# Altium schematic sheet 5_radio_0.schdoc: Radio 0
size A4; DrawnBy: Sara Vega Martinez; Revision: v0.1; SheetNumber: 5; SheetTotal: 6; DesignedBy: André M. P. Mattos
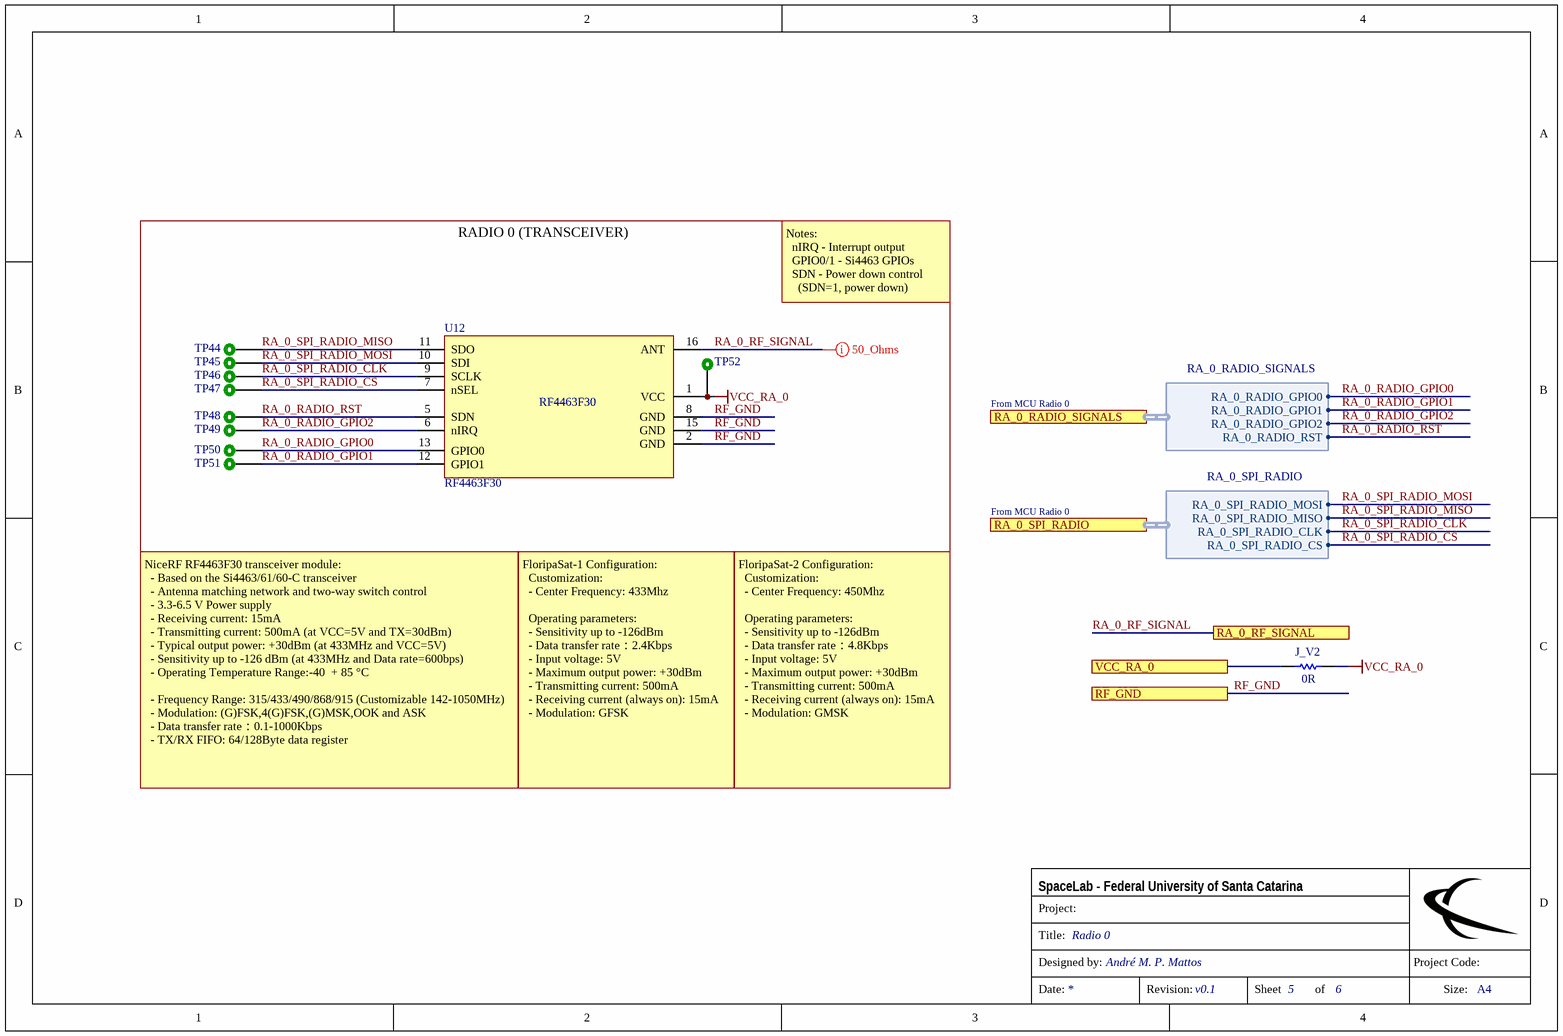
[diagram p0: 5_radio_0.schdoc]

## Parts
J_V2  0R  [0805]
TP44  TEST_POINT  [TEST_POINT_2]  (value not drawn)  (no BOM)
TP45  TEST_POINT  [TEST_POINT_2]  (value not drawn)  (no BOM)
TP46  TEST_POINT  [TEST_POINT_2]  (value not drawn)  (no BOM)
TP47  TEST_POINT  [TEST_POINT_2]  (value not drawn)  (no BOM)
TP48  TEST_POINT  [TEST_POINT_2]  (value not drawn)  (no BOM)
TP49  TEST_POINT  [TEST_POINT_2]  (value not drawn)  (no BOM)
TP50  TEST_POINT  [TEST_POINT_2]  (value not drawn)  (no BOM)
TP51  TEST_POINT  [TEST_POINT_2]  (value not drawn)  (no BOM)
TP52  TEST_POINT  [TEST_POINT_2]  (value not drawn)  (no BOM)
U12  RF4463F30  [RF4463F30]

## Blocks framed on the sheet
RADIO 0 (TRANSCEIVER): TP44-TP52 U12

## Ports
RA_0_RADIO_SIGNALS (harness RA_0_RADIO_SIGNALS), RA_0_RF_SIGNAL, RA_0_SPI_RADIO (harness RA_0_SPI_RADIO), RF_GND, VCC_RA_0

## Harnesses
RA_0_RADIO_SIGNALS: RA_0_RADIO_GPIO2, RA_0_RADIO_RST, RA_0_RADIO_GPIO0, RA_0_RADIO_GPIO1
RA_0_SPI_RADIO: RA_0_SPI_RADIO_CLK, RA_0_SPI_RADIO_MISO, RA_0_SPI_RADIO_MOSI, RA_0_SPI_RADIO_CS

## Nets
VCC_RA_0: J_V2.1 TP52.1 U12.1(VCC)
RA_0_RADIO_GPIO0: TP50.1 U12.13(GPIO0) ; port RA_0_RADIO_SIGNALS.RA_0_RADIO_GPIO0
RA_0_RADIO_GPIO1: TP51.1 U12.12(GPIO1) ; port RA_0_RADIO_SIGNALS.RA_0_RADIO_GPIO1
RA_0_RADIO_GPIO2: TP49.1 U12.6(nIRQ) ; port RA_0_RADIO_SIGNALS.RA_0_RADIO_GPIO2
RA_0_RADIO_RST: TP48.1 U12.5(SDN) ; port RA_0_RADIO_SIGNALS.RA_0_RADIO_RST
RA_0_RF_SIGNAL: U12.16(ANT) ; port RA_0_RF_SIGNAL
RA_0_SPI_RADIO_CLK: TP46.1 U12.9(SCLK) ; port RA_0_SPI_RADIO.RA_0_SPI_RADIO_CLK
RA_0_SPI_RADIO_CS: TP47.1 U12.7(nSEL) ; port RA_0_SPI_RADIO.RA_0_SPI_RADIO_CS
RA_0_SPI_RADIO_MISO: TP44.1 U12.11(SDO) ; port RA_0_SPI_RADIO.RA_0_SPI_RADIO_MISO
RA_0_SPI_RADIO_MOSI: TP45.1 U12.10(SDI) ; port RA_0_SPI_RADIO.RA_0_SPI_RADIO_MOSI
RF_GND: U12.2(GND) U12.8(GND) U12.15(GND) ; port RF_GND
VCC_RA_0: J_V2.2 ; port VCC_RA_0  [a separate net that carries the same name]

## Layout directives
net class 50Ohm_Net: RA_0_RF_SIGNAL

## Notes on the sheet
- Notes:
  nIRQ - Interrupt output
  GPIO0/1 - Si4463 GPIOs
  SDN - Power down control
  (SDN=1, power down)
- From MCU Radio 0
- NiceRF RF4463F30 transceiver module:
  - Based on the Si4463/61/60-C transceiver
  - Antenna matching network and two-way switch control
  - 3.3-6.5 V Power supply
  - Receiving current: 15mA
  - Transmitting current: 500mA (at VCC=5V and TX=30dBm)
  - Typical output power: +30dBm (at 433MHz and VCC=5V)
  - Sensitivity up to -126 dBm (at 433MHz and Data rate=600bps)
  - Operating Temperature Range:-40  + 85 °C
  - Frequency Range: 315/433/490/868/915 (Customizable 142-1050MHz)
  - Modulation: (G)FSK,4(G)FSK,(G)MSK,OOK and ASK
  - Data transfer rate：0.1-1000Kbps
  - TX/RX FIFO: 64/128Byte data register
- FloripaSat-1 Configuration:
  Customization:
  - Center Frequency: 433Mhz
  Operating parameters:
  - Sensitivity up to -126dBm
  - Data transfer rate：2.4Kbps
  - Input voltage: 5V
  - Maximum output power: +30dBm
  - Transmitting current: 500mA
  - Receiving current (always on): 15mA
  - Modulation: GFSK
- FloripaSat-2 Configuration:
  Customization:
  - Center Frequency: 450Mhz
  Operating parameters:
  - Sensitivity up to -126dBm
  - Data transfer rate：4.8Kbps
  - Input voltage: 5V
  - Maximum output power: +30dBm
  - Transmitting current: 500mA
  - Receiving current (always on): 15mA
  - Modulation: GMSK
- Project:
- SpaceLab - Federal University of Santa Catarina
- Title:
- Designed by:
- Project Code:
- Date:
- Revision:
- Sheet
- of
- Size:
- A4

## Library data of the parts
J_V2 = R0R_JUMPER_1/16W_0805: RES 0R OHM 1/16W JUMPER 0805; Partnumber: CRCW08050000Z0EA; NCM: 8533.21.20
TP44-TP52 = TEST_POINT: Test point
U12 = RF4463F30: RF4463F30 High Power Wireless Transceiver Module; Partnumber: RF4463F30